# Altium project Tx_TFT_PCB.PrjPcb (part 2 of 2)

## Sheet Power_2.SchDoc
size A4; Organization: Altium Limited; Address1: L3, 12a Rodborough Rd; Address2: Frenchs Forest; Address3: NSW; Address4: Australia 2086
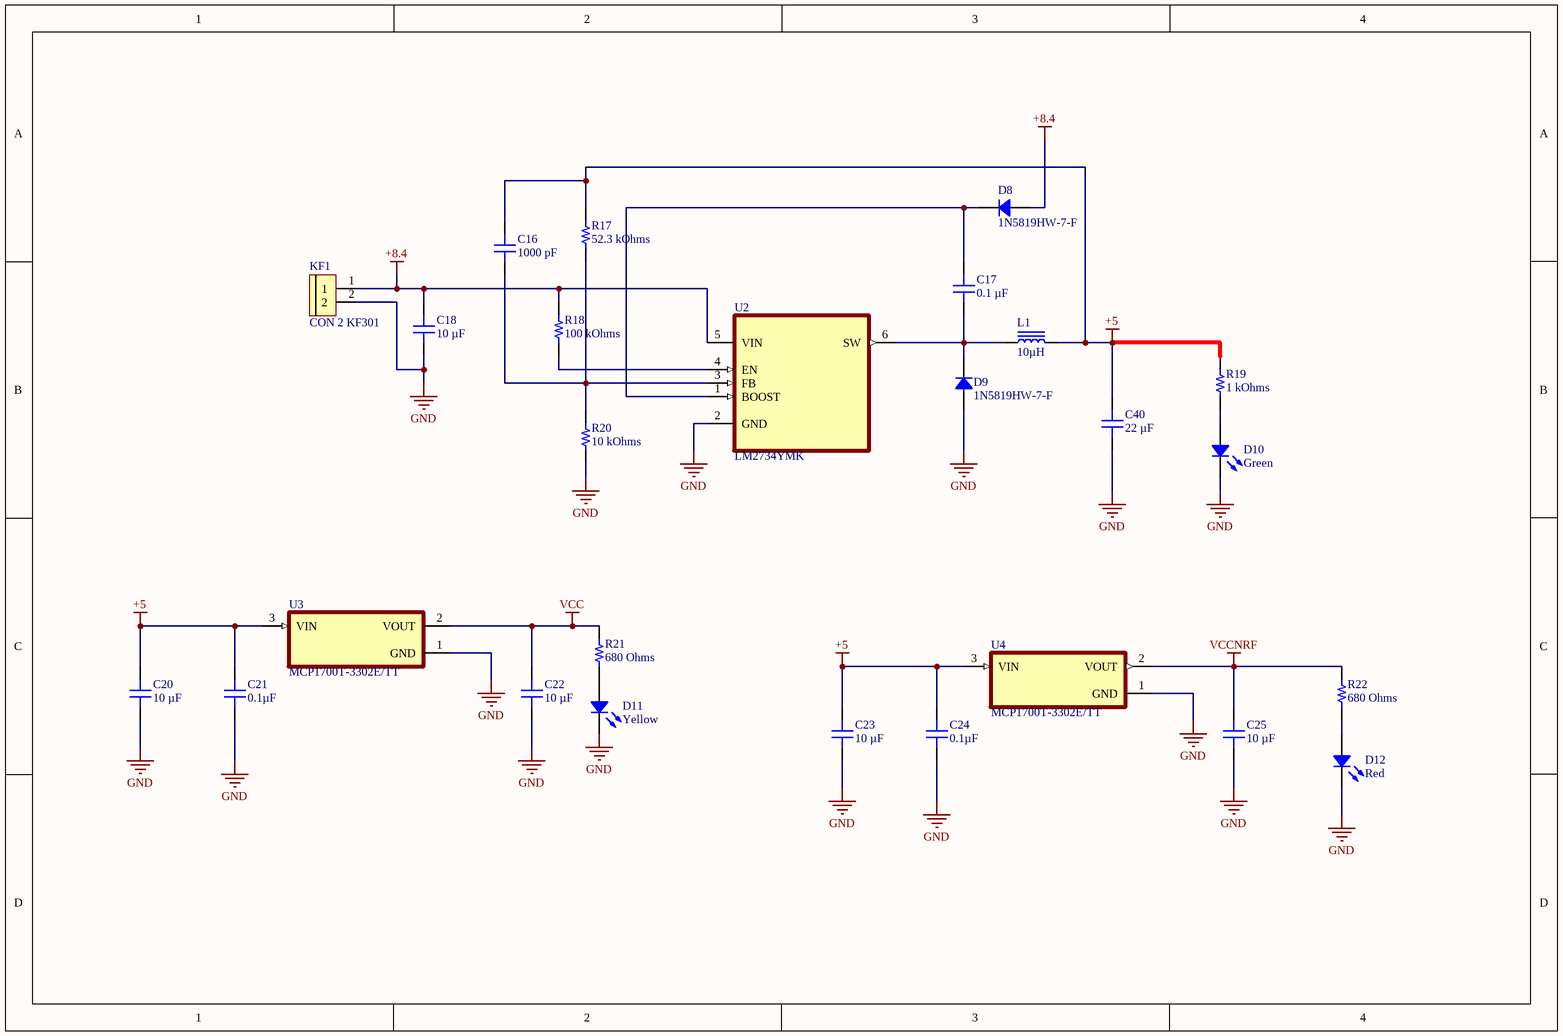
[diagram p2: Power_2.SchDoc]

### Parts
C16  1000 pF  [CAP 0603_1608]
C17  0.1 µF  [CAP 0603_1608]
C18  10 µF  [CAP 0805_2012]
C20  10 µF  [CAP 0805_2012]
C21  0.1µF  [CAP 0603_1608]
C22  10 µF  [CAP 0603_1608]
C23  10 µF  [CAP 0805_2012]
C24  0.1µF  [CAP 0603_1608]
C25  10 µF  [CAP 0603_1608]
C40  22 µF  [CAP 0805_2012]
D8  1N5819HW-7-F  [SOD-123]
D9  1N5819HW-7-F  [SOD-123]
D10  Green  [LED 0603_1608 GREEN]
D11  Yellow  [LED 0603_1608 YELLOW]
D12  Red  [LED 0603_1608 RED]
KF1  CON 2 KF301  [Con 2 KF301 5.08]
L1  10µH  [TDK SLF7032]
R17  52.3 kOhms  [RES 0603_1608]
R18  100 kOhms  [RES 0603_1608]
R19  1 kOhms  [RES 0603_1608]
R20  10 kOhms  [RES 0603_1608]
R21  680 Ohms  [RES 0603_1608]
R22  680 Ohms  [RES 0603_1608]
U2  LM2734YMK  [SOT95P285X100-6N]
U3  MCP1700T-3302E/TT  [SOT95P237X112-3N]
U4  MCP1700T-3302E/TT  [SOT95P237X112-3N]

### Nets
+5: C16.2 C20.2 C21.2 C23.2 C24.2 C40.2 L1.2 R17.2 R19.2 U3.3(VIN) U4.3(VIN)
+8.4: C18.2 D8.1 KF1.1 R18.2 U2.5(VIN)
GND: C18.1 C20.1 C21.1 C22.1 C23.1 C24.1 C25.1 C40.1 D9.1 D10.2 D11.2 D12.2 KF1.2 R20.1 U2.2(GND) U3.1(GND) U4.1(GND)
VCC: C22.2 R21.2 U3.2(VOUT)
VCCNRF: C25.2 R22.2 U4.2(VOUT)
NetC16_1: C16.1 R17.1 R20.2 U2.3(FB)
NetC17_1: C17.1 D9.2 L1.1 U2.6(SW)
NetC17_2: C17.2 D8.2 U2.1(BOOST)
NetD10_1: D10.1 R19.1
NetD11_1: D11.1 R21.1
NetD12_1: D12.1 R22.1
NetR18_1: R18.1 U2.4(EN)

### Notes on the sheet
- Title
- Size:
- Date:
- A4
- Number:
- Time:
- Revision:
- Sheet
- of
- File:

### Library data of the parts
C16 = VJ0603Y102KXQCW1BC: CAP CER 1000PF 10V X7R 0603; manufacturer: Vishay Vitramon; Tolerance: ±10%; Part Number: VJ0603Y102KXQCW1BC; Value: 1000 pF; Applications: General Purpose; Capacitance: 1000 pF; componentlink1description: Datasheet; componentlink1url: https://www.vishay.com/docs/28548/vjw1bcbascomseries.pdf; componentlink2description: DigiKey Link; componentlink2url: https://www.digikey.com/en/products/detail/vishay-vitramon/VJ0603Y102KXQCW1BC/8305229; Device Package: 0603 (1608 Metric); lastupdated: 2/9/2024 8:10:13 PM; Lifecycle Status: Active; Minimum Order: 1; Mounting Type: Surface Mount, MLCC; Operating Temperature: -55°C ~ 125°C; Package / Case: 0603 (1608 Metric); packaging: TapeAndReel; partid: 14875; Part Status: Active; price: 0.01; series: VJ W1BC; Size / Dimension: 0.063" L x 0.031" W (1.60mm x 0.80mm); Supplier 1: DigiKey; Supplier Part Number 1: 720-1679-1-ND; Temperature Coefficient: X7R; Thickness (Max): 0.034" (0.87mm); Voltage - Rated: 10V
C17 = CX0603MRX7R6BB104: CAP CER 0.1UF 10V X7R 0603; manufacturer: PulseLarsen Antennas; Tolerance: ±20%; Part Number: CX0603MRX7R6BB104; Value: 0.1 µF; Applications: Bypass, Decoupling; Capacitance: 0.1 µF; componentlink1description: Datasheet; componentlink1url: https://productfinder.pulseelectronics.com/api/open/product-attachments/datasheet/cx0805mrx7r0bb102; componentlink2description: DigiKey Link; componentlink2url: https://www.digikey.com/en/products/detail/pulselarsen-antennas/CX0603MRX7R6BB104/1219074; Device Package: 0603 (1608 Metric); Features: Low ESL (X2Y); lastupdated: 2/9/2024 8:09:55 PM; Lifecycle Status: Active; Minimum Order: 1; Mounting Type: Surface Mount, MLCC; Operating Temperature: -55°C ~ 125°C; Package / Case: 0603 (1608 Metric); packaging: TapeAndReel; partid: 34696; Part Status: Active; price: 0.09; series: X2Y®; Size / Dimension: 0.063" L x 0.033" W (1.60mm x 0.85mm); Supplier 1: DigiKey; Supplier Part Number 1: 311-1237-1-ND; Temperature Coefficient: X7R; Thickness (Max): 0.030" (0.75mm); Voltage - Rated: 10V
C18 = CL21A106KOQNNWE: CAP CER 10UF 16V X5R 0805; manufacturer: Samsung Electro-Mechanics; Tolerance: ±10%; Part Number: CL21A106KOQNNWE; Value: 10 µF; Applications: General Purpose; Capacitance: 10 µF; componentlink1description: Datasheet; componentlink1url: http://www.samsungsem.com/kr/support/product-search/mlcc/CL21A106KOQNNWE.jsp; componentlink2description: DigiKey Link; componentlink2url: https://www.digikey.com/en/products/detail/samsung-electro-mechanics/CL21A106KOQNNWE/3888552; Device Package: 0805 (2012 Metric); lastupdated: 2/9/2024 8:15:45 PM; Lifecycle Status: Active; Minimum Order: 1; Mounting Type: Surface Mount, MLCC; Operating Temperature: -55°C ~ 85°C; Package / Case: 0805 (2012 Metric); packaging: TapeAndReel; partid: 11753; Part Status: Active; price: 0.02; series: CL; Size / Dimension: 0.079" L x 0.049" W (2.00mm x 1.25mm); Supplier 1: DigiKey; Supplier Part Number 1: 1276-2894-1-ND; Temperature Coefficient: X5R; Thickness (Max): 0.055" (1.40mm); Voltage - Rated: 16V
C20 C23 = CL21A106KOQNNNG: CAP CER 10UF 16V X5R 0805; manufacturer: Samsung Electro-Mechanics; Tolerance: ±10%; Part Number: CL21A106KOQNNNG; Value: 10 µF; Applications: General Purpose; Capacitance: 10 µF; componentlink1description: Datasheet; componentlink1url: http://www.samsungsem.com/kr/support/product-search/mlcc/CL21A106KOQNNNG.jsp; componentlink2description: DigiKey Link; componentlink2url: https://www.digikey.com/en/products/detail/samsung-electro-mechanics/CL21A106KOQNNNG/3894417; Device Package: 0805 (2012 Metric); lastupdated: 2/9/2024 8:15:59 PM; Lifecycle Status: Active; Minimum Order: 1; Mounting Type: Surface Mount, MLCC; Operating Temperature: -55°C ~ 85°C; Package / Case: 0805 (2012 Metric); packaging: TapeAndReel; partid: 39874; Part Status: Active; price: 0.01; series: CL; Size / Dimension: 0.079" L x 0.049" W (2.00mm x 1.25mm); Supplier 1: DigiKey; Supplier Part Number 1: 1276-6455-1-ND; Temperature Coefficient: X5R; Thickness (Max): 0.055" (1.40mm); Voltage - Rated: 16V
C21 = LD03ZC104KAB2A: CAP CER 0.1UF 10V X7R 0603; manufacturer: AVX Corporation; Tolerance: ±10%; Part Number: LD03ZC104KAB2A; Value: 0.1µF; Applications: General Purpose; Capacitance: 0.1µF; componentlink1description: Datasheet; componentlink1url: http://datasheets.avx.com/LD-Series.pdf; componentlink2description: DigiKey Link; componentlink2url: http://digikey.com/product-detail/en/avx-corporation/LD03ZC104KAB2A/478-12926-1-ND/9949296; Device Package: 0603 (1608 Metric); lastupdated: 9/2/2020 1:03:06 AM; Lifecycle Status: Active; Minimum Order: 1; Mounting Type: Surface Mount, MLCC; Operating Temperature: -55°C ~ 125°C; Package / Case: 0603 (1608 Metric); packaging: TapeAndReel; partid: 16481; Part Status: Active; price: 0.17; series: LD; Size / Dimension: 0.063" L x 0.032" W (1.60mm x 0.81mm); Supplier 1: DigiKey; Supplier Part Number 1: 478-12926-1-ND; Temperature Coefficient: X7R; Thickness (Max): 0.035" (0.90mm); Voltage - Rated: 10V
C22 C25 = KGM15CS61A106MT: CAP CER 10UF 10V X6S 0603; manufacturer: KYOCERA AVX; Tolerance: ±20%; Part Number: KGM15CS61A106MT; Value: 10 µF; Applications: General Purpose; Capacitance: 10 µF; componentlink1description: Datasheet; componentlink1url: https://ele.kyocera.com/assets/products/capacitor/CM_Series_e.pdf; componentlink2description: DigiKey Link; componentlink2url: https://www.digikey.com/en/products/detail/kyocera-avx/KGM15CS61A106MT/12397342; Device Package: 0603 (1608 Metric); lastupdated: 2/9/2024 8:09:23 PM; Lifecycle Status: Active; Minimum Order: 1; Mounting Type: Surface Mount, MLCC; Operating Temperature: -55°C ~ 105°C; Package / Case: 0603 (1608 Metric); packaging: TapeAndReel; partid: 51317; Part Status: Active; price: 0.04; series: KGM - X6S; Size / Dimension: 0.063" L x 0.031" W (1.60mm x 0.80mm); Supplier 1: DigiKey; Supplier Part Number 1: 478-KGM15CS61A106MTCT-ND; Temperature Coefficient: X6S; Thickness (Max): 0.039" (1.00mm); Voltage - Rated: 10V
C24 = 0603YC104JAZ2A: CAP CER 0.1UF 16V X7R 0603; manufacturer: AVX Corporation; Tolerance: ±5%; Part Number: 0603YC104JAZ2A; Value: 0.1µF; Applications: Boardflex Sensitive; Capacitance: 0.1µF; componentlink1description: Datasheet; componentlink1url: http://datasheets.avx.com/FlexitermMLCC.pdf; componentlink2description: DigiKey Link; componentlink2url: http://digikey.com/product-detail/en/avx-corporation/0603YC104JAZ2A/478-5291-1-ND/1950958; Device Package: 0603 (1608 Metric); Features: Soft Termination; lastupdated: 9/2/2020 1:03:16 AM; Lifecycle Status: Active; Minimum Order: 1; Mounting Type: Surface Mount, MLCC; Operating Temperature: -55°C ~ 125°C; Package / Case: 0603 (1608 Metric); packaging: TapeAndReel; partid: 13201; Part Status: Active; price: 0.11; series: FLEXITERM®; Size / Dimension: 0.063" L x 0.032" W (1.60mm x 0.81mm); Supplier 1: DigiKey; Supplier Part Number 1: 478-5291-1-ND; Temperature Coefficient: X7R; Thickness (Max): 0.035" (0.90mm); Voltage - Rated: 16V
C40 = C2012X5R1A226M125AE: CAP CER 22UF 10V X5R 0805; manufacturer: TDK Corporation; Tolerance: ±20%; Part Number: C2012X5R1A226M125AE; Value: 22 µF; Applications: Boardflex Sensitive; Capacitance: 22 µF; componentlink1description: Datasheet; componentlink1url: https://product.tdk.com/info/en/catalog/datasheets/mlcc_commercial_soft_en.pdf?ref_disty=digikey; componentlink2description: DigiKey Link; componentlink2url: https://www.digikey.com/en/products/detail/tdk-corporation/C2012X5R1A226M125AE/9991384; Device Package: 0805 (2012 Metric); Features: Soft Termination; lastupdated: 2/9/2024 8:15:35 PM; Lifecycle Status: Active; Minimum Order: 1; Mounting Type: Surface Mount, MLCC; Operating Temperature: -55°C ~ 85°C; Package / Case: 0805 (2012 Metric); packaging: TapeAndReel; partid: 39859; Part Status: Active; price: 0.36; series: C; Size / Dimension: 0.079" L x 0.049" W (2.00mm x 1.25mm); Supplier 1: DigiKey; Supplier Part Number 1: 445-C2012X5R1A226M125AECT-ND; Temperature Coefficient: X5R; Thickness (Max): 0.059" (1.50mm); Voltage - Rated: 10V
D8 D9 = 1N5819HW-7-F: DIODE SCHOTTKY 40V 1A SOD123; Manufacturer: Diodes Incorporated; Capacitance @ Vr, F: 60pF @ 4V, 1MHz; Current - Reverse Leakage @ Vr: 1 mA @ 40 V; Speed: Fast Recovery =< 500ns, > 200mA (Io); Voltage - Forward (Vf) (Max) @ If: 450 mV @ 1 A; Part Number: 1N5819HW-7-F; ComponentLink1Description: Datasheet; ComponentLink1URL: https://www.diodes.com/assets/Datasheets/ds30217.pdf; ComponentLink2Description: DigiKey Link; ComponentLink2URL: https://www.digikey.com/en/products/detail/diodes-incorporated/1N5819HW-7-F/814970; Current - Average Rectified (Io): 1A; Diode Type: Schottky; LastUpdated: 6/3/2024 7:54:46 PM; Lifecycle Status: Active; Minimum Order: 1; Mounting Type: Surface Mount; Operating Temperature - Junction: -65°C ~ 125°C; Package / Case: SOD-123; Packaging: TapeAndReel; PartId: 2212; Part Status: Active; Price: 0.05; Series: -; Supplier 1: DigiKey; Supplier Part Number 1: 1N5819HW-FDICT-ND; Supplier Device Package: SOD-123; Voltage - DC Reverse (Vr) (Max): 40 V
D10 = QBLP601-IG: LED GREEN CLEAR 0603 SMD; Manufacturer: QT Brightek (QTB); Configuration: Standard; Current - Test: 20mA; Lens Color: Colorless; Lens Size: 1.10mm x 0.80mm; Lens Style: Rectangle with Flat Top; Millicandela Rating: 450mcd; Viewing Angle: 140°; Voltage - Forward (Vf) (Typ): 3.2V; Wavelength - Dominant: 525nm; Part Number: QBLP601-IG; Color: Green; ComponentLink1Description: Datasheet; ComponentLink1URL: http://www.qt-brightek.com/datasheet/QBLP601_series.pdf; ComponentLink2Description: DigiKey Link; ComponentLink2URL: https://www.digikey.com/en/products/detail/qt-brightek-qtb/QBLP601-IG/4814653; Device Package: 0603 (1608 Metric); Height (Max): 0.60mm; LastUpdated: 6/3/2024 7:58:52 PM; Lens Transparency: Clear; Lifecycle Status: Active; Minimum Order: 1; Mounting Type: Surface Mount; Package / Case: 0603 (1608 Metric); Packaging: TapeAndReel; PartId: 668; Part Status: Active; Price: 0.06; Series: QBLP601; Size / Dimension: 1.60mm L x 0.80mm W; Supplier 1: DigiKey; Supplier Part Number 1: 1516-1055-1-ND; Supplier Device Package: 0603; Value: Green
D11 = VAOL-S6YP4: LED YELLOW CLEAR 0603 SMD; Manufacturer: Visual Communications Company - VCC; Configuration: Standard; Current - Test: 10mA; Lens Color: Colorless; Lens Size: 1.20mm x 0.80mm; Lens Style: Rectangle with Flat Top; Millicandela Rating: 33mcd; Viewing Angle: 120°; Voltage - Forward (Vf) (Typ): 1.9V; Wavelength - Dominant: 591nm; Part Number: VAOL-S6YP4; Color: Yellow; ComponentLink1Description: Datasheet; ComponentLink1URL: http://vcclite.com/_pdf/VAOL-S6YP4-LED-0603-yellow.pdf; ComponentLink2Description: DigiKey Link; ComponentLink2URL: http://digikey.com/product-detail/en/visual-communications-company-vcc/VAOL-S6YP4/VAOL-S6YP4CT-ND/5176154; Device Package: 0603 (1608 Metric); Height (Max): 0.60mm; LastUpdated: 6/3/2024 8:01:09 PM; Lens Transparency: Clear; Lifecycle Status: Active; Minimum Order: 1; Mounting Type: Surface Mount; Package / Case: 0603 (1608 Metric); Packaging: TapeAndReel; PartId: 153; Part Status: Active; Price: 0.09; Series: -; Size / Dimension: 1.60mm L x 0.80mm W; Supplier 1: DigiKey; Supplier Part Number 1: VAOL-S6YP4CT-ND; Supplier Device Package: 0603; Value: Yellow; Wavelength - Peak: 591nm
D12 = B18W1URO-20C000114U1930: LED RED CLEAR 0603 SMD; Manufacturer: Harvatek Corporation; Current - Test: 20mA; Lens Color: Colorless; Lens Size: 0.80mm Dia; Lens Style: Round with Flat Top; Millicandela Rating: 360mcd; Viewing Angle: 55°; Voltage - Forward (Vf) (Typ): 2.1V; Wavelength - Dominant: 630nm; Wavelength - Peak: 639nm; Part Number: B18W1URO-20C000114U1930; Color: Red; ComponentLink1Description: Datasheet; ComponentLink1URL: https://media.digikey.com/pdf/Data%20Sheets/Harvatek%20PDFs/B18W1URO-20C000114U1930.pdf; ComponentLink2Description: DigiKey Link; ComponentLink2URL: https://www.digikey.com/en/products/detail/harvatek-corporation/B18W1URO-20C000114U1930/16671735; Device Package: 0603 (1608 Metric); Height (Max): 1.05mm; LastUpdated: 6/3/2024 7:59:44 PM; Lens Transparency: Clear; Lifecycle Status: Active; Minimum Order: 1; Mounting Type: Surface Mount; Package / Case: 0603 (1608 Metric); Packaging: TapeAndReel; PartId: 1174; Part Status: Active; Price: 0.16; Series: B18W1URO; Size / Dimension: 1.60mm L x 0.80mm W; Supplier 1: DigiKey; Supplier Part Number 1: 3147-B18W1URO-20C000114U1930CT-ND; Supplier Device Package: 0603; Value: Red
KF1 = CON 2 KF301: Cắm; Ma_Hang: MH000987; Ten_Linh_Kien: CON 2 KF301-2P 5.08MM Xanh Dương; Chung_Loai: Cắm; Ghi_Chu: *; Kieu_Chan: *; Don_Vi: Con
L1 = SLF7032T-100M1R4-2PF: FIXED IND 10UH 1.4A 63.6 MOHM; Manufacturer: TDK Corporation; DC Resistance (DCR): 63.6mOhm Max; Inductance Frequency - Test: 100kHz; Material - Core: Ferrite; Shielding: Shielded; Tolerance: ±20%; Type: Wirewound; Part Number: SLF7032T-100M1R4-2PF; ComponentLink1Description: Datasheet; ComponentLink1URL: //media.digikey.com/pdf/Data%20Sheets/TDK%20PDFs/SLF7032_Type.pdf; ComponentLink2Description: DigiKey Link; ComponentLink2URL: http://digikey.com/product-detail/en/tdk-corporation/SLF7032T-100M1R4-2PF/445-1998-1-ND/755405; Current Rating (Amps): 1.4A; Device Package: Nonstandard; Height - Seated (Max): 0.134" (3.40mm); Inductance: 10µH; LastUpdated: 9/2/2020 1:30:24 AM; Lifecycle Status: Active; Minimum Order: 1; Mounting Type: Surface Mount; Operating Temperature: -40°C ~ 105°C; Package / Case: Nonstandard; Packaging: TapeAndReel; PartId: 3677; Part Status: Active; Price: 0.43; Series: SLF; Size / Dimension: 0.276" L x 0.276" W (7.00mm x 7.00mm); Supplier 1: DigiKey; Supplier Part Number 1: 445-1998-1-ND; Value: 10µH
R17 = RMEF0603FT52K3: RES 52.3K OHM 1% 1/10W 0603; Manufacturer: Stackpole Electronics Inc; Power (Watts): 0.1W, 1/10W; Ratings: 7C1 RoHS w/out Exemption (100% Pb-Free), AEC-Q200; Temperature Coefficient: ±100ppm/°C; Part Number: RMEF0603FT52K3; Value: 52.3 kOhms; ComponentLink1Description: Datasheet; ComponentLink1URL: https://www.seielect.com/Catalog/SEI-RMEF.pdf; ComponentLink2Description: DigiKey Link; ComponentLink2URL: https://www.digikey.com/en/products/detail/stackpole-electronics-inc/RMEF0603FT52K3/16839815; Composition: Thick Film; Device Package: 0603 (1608 Metric); Features: Automotive AEC-Q200; Height - Seated (Max): 0.020" (0.50mm); LastUpdated: 2/9/2024 8:41:04 PM; Lifecycle Status: Active; Minimum Order: 1; Number of Terminations: 2; Operating Temperature: -55°C ~ 155°C; Package / Case: 0603 (1608 Metric); Packaging: TapeAndReel; PartId: 69499; Part Status: Active; Price: 0.01; Resistance: 52.3 kOhms; Series: RMEF; Size / Dimension: 0.063" L x 0.031" W (1.60mm x 0.80mm); Supplier 1: DigiKey; Supplier Part Number 1: 738-RMEF0603FT52K3CT-ND; Supplier Device Package: 0603; Tolerance: ±1%
R18 = TNPW0603100KBXEN: RES 100K OHM 0.1% 1/10W 0603; Manufacturer: Vishay Dale; Power (Watts): 0.1W, 1/10W; Temperature Coefficient: ±15ppm/°C; Part Number: TNPW0603100KBXEN; Value: 100 kOhms; ComponentLink1Description: Datasheet; ComponentLink1URL: http://www.vishay.com/docs/28758/tnpw_e3.pdf; ComponentLink2Description: DigiKey Link; ComponentLink2URL: https://www.digikey.com/en/products/detail/vishay-dale/TNPW0603100KBXEN/4155839; Composition: Thin Film; Device Package: 0603 (1608 Metric); Features: Anti-Sulfur, Automotive AEC-Q200, Moisture Resistant; Height - Seated (Max): 0.022" (0.55mm); LastUpdated: 2/9/2024 8:42:03 PM; Lifecycle Status: Active; Minimum Order: 1; Number of Terminations: 2; Operating Temperature: -55°C ~ 155°C; Package / Case: 0603 (1608 Metric); Packaging: TapeAndReel; PartId: 25339; Part Status: Active; Price: 0.31; Ratings: AEC-Q200; Resistance: 100 kOhms; Series: TNPW e3; Size / Dimension: 0.063" L x 0.033" W (1.60mm x 0.85mm); Supplier 1: DigiKey; Supplier Part Number 1: 541-1721-1-ND; Supplier Device Package: 0603; Tolerance: ±0.1%
R19 = RG1608V-102-B-T5: RES SMD 1K OHM 0.1% 1/10W 0603; Manufacturer: Susumu; Power (Watts): 0.1W, 1/10W; Temperature Coefficient: ±5ppm/°C; Part Number: RG1608V-102-B-T5; Value: 1 kOhms; ComponentLink1Description: Datasheet; ComponentLink1URL: https://www.susumu.co.jp/common/pdf/n_catalog_partition01_en.pdf; ComponentLink2Description: DigiKey Link; ComponentLink2URL: https://www.digikey.com/en/products/detail/susumu/RG1608V-102-B-T5/1258937; Composition: Thin Film; Device Package: 0603 (1608 Metric); Features: Anti-Sulfur, Automotive AEC-Q200; Height - Seated (Max): 0.020" (0.50mm); LastUpdated: 2/9/2024 8:40:32 PM; Lifecycle Status: Active; Minimum Order: 1; Number of Terminations: 2; Operating Temperature: -55°C ~ 155°C; Package / Case: 0603 (1608 Metric); Packaging: TapeAndReel; PartId: 82062; Price: 0.78; Ratings: AEC-Q200; Resistance: 1 kOhms; Series: RG; Size / Dimension: 0.063" L x 0.031" W (1.60mm x 0.80mm); Supplier 1: DigiKey; Supplier Part Number 1: 408-RG1608V-102-B-T5CT-ND; Supplier Device Package: 0603; Tolerance: ±0.1%
R20 = CPF-A-0603B10KE1: RES SMD 10K OHM 0.1% 1/16W 0603; Manufacturer: TE Connectivity Passive Product; Power (Watts): 0.063W, 1/16W; Temperature Coefficient: ±25ppm/°C; Part Number: CPF-A-0603B10KE1; Value: 10 kOhms; ComponentLink1Description: Datasheet; ComponentLink1URL: https://www.te.com/commerce/DocumentDelivery/DDEController?Action=srchrtrv&DocNm=1773200-1&DocType=DS&DocLang=English; ComponentLink2Description: DigiKey Link; ComponentLink2URL: https://www.digikey.com/en/products/detail/te-connectivity-passive-product/CPF-A-0603B10KE1/5586834; Composition: Thin Film; Device Package: 0603 (1608 Metric); Features: Anti-Sulfur, Automotive AEC-Q200, Moisture Resistant; Height - Seated (Max): 0.022" (0.55mm); LastUpdated: 2/9/2024 8:40:47 PM; Lifecycle Status: Active; Minimum Order: 1; Number of Terminations: 2; Operating Temperature: -55°C ~ 155°C; Package / Case: 0603 (1608 Metric); Packaging: TapeAndReel; PartId: 75468; Part Status: Active; Price: 0.12; Ratings: AEC-Q200; Resistance: 10 kOhms; Series: CPF-A, Neohm; Size / Dimension: 0.061" L x 0.031" W (1.55mm x 0.80mm); Supplier 1: DigiKey; Supplier Part Number 1: 1712-CPF-A-0603B10KE1CT-ND; Supplier Device Package: 0603; Tolerance: ±0.1%
R21 R22 = CPF-A-0603B680RE: RES SMD 680 OHM 0.1% 1/16W 0603; Manufacturer: TE Connectivity Passive Product; Power (Watts): 0.063W, 1/16W; Temperature Coefficient: ±25ppm/°C; Part Number: CPF-A-0603B680RE; Value: 680 Ohms; ComponentLink1Description: Datasheet; ComponentLink1URL: https://www.te.com/commerce/DocumentDelivery/DDEController?Action=srchrtrv&DocNm=1773200-1&DocType=DS&DocLang=English; ComponentLink2Description: DigiKey Link; ComponentLink2URL: https://www.digikey.com/en/products/detail/te-connectivity-passive-product/CPF-A-0603B680RE/5583848; Composition: Thin Film; Device Package: 0603 (1608 Metric); Features: Anti-Sulfur, Automotive AEC-Q200, Moisture Resistant; Height - Seated (Max): 0.022" (0.55mm); LastUpdated: 2/9/2024 8:42:04 PM; Lifecycle Status: Active; Minimum Order: 1; Number of Terminations: 2; Operating Temperature: -55°C ~ 155°C; Package / Case: 0603 (1608 Metric); Packaging: TapeAndReel; PartId: 25303; Part Status: Active; Price: 0.09; Ratings: AEC-Q200; Resistance: 680 Ohms; Series: CPF-A, Neohm; Size / Dimension: 0.061" L x 0.031" W (1.55mm x 0.80mm); Supplier 1: DigiKey; Supplier Part Number 1: 1712-CPF-A-0603B680RECT-ND; Supplier Device Package: 0603; Tolerance: ±0.1%
U2 = LM2734YMK: Buck Switching Regulator IC Positive Adjustable 0.8V 1 Output 1A SOT-23-6 Thin, TSOT-23-6; MF: Texas Instruments; SnapEDA_Link: https://www.snapeda.com/parts/LM2734YMK/Texas%20Instruments/view-part/105783/?ref=snap; Price: None; Availability: Unavailable; Package: SOT-23 Texas Instruments; MP: LM2734YMK; Value: *
U3 U4 = MCP1700T-3302E/TT: Linear Voltage Regulator IC 1 Output 250mA SOT-23-3; MF: Microchip; Availability: Unavailable; Value: *; Package: SOT-23-3 Microchip; Price: None; MP: MCP1700T-3302E/TT; SnapEDA_Link: https://www.snapeda.com/parts/MCP1700T-3302E/TT/Microchip/view-part/50877/?ref=snap

## Sheet USB_C.SchDoc
size A3; Organization: Altium Limited; Address1: L3, 12a Rodborough Rd; Address2: Frenchs Forest; Address3: NSW; Address4: Australia 2086
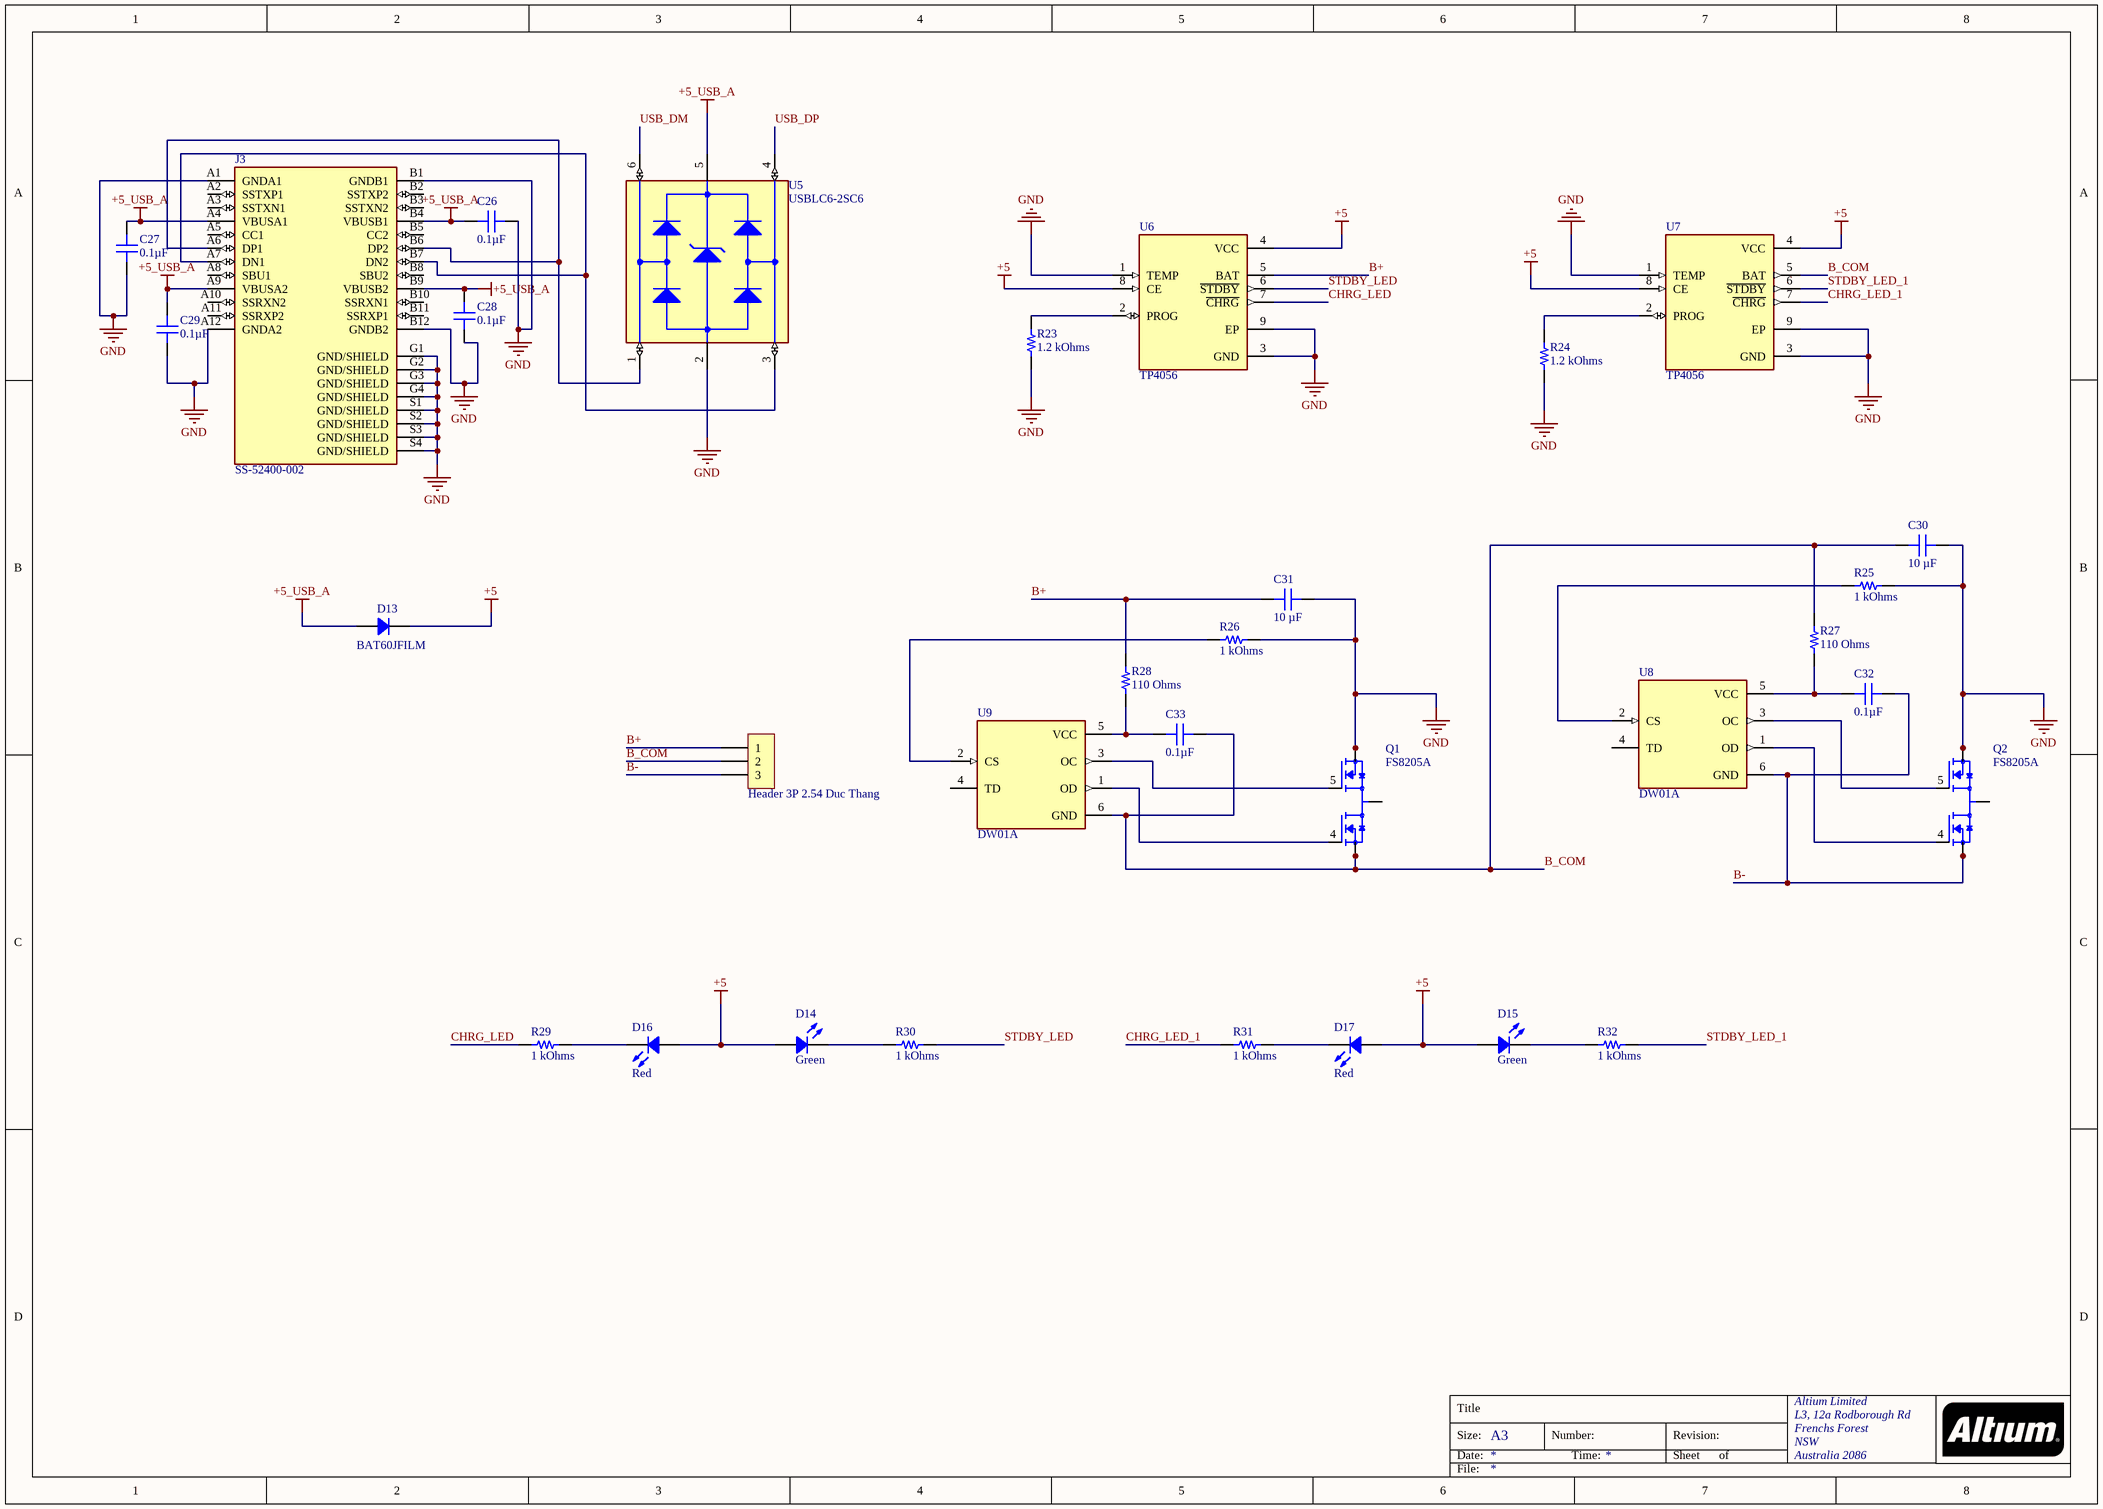
[diagram p3: USB_C.SchDoc]

### Parts
C26  0.1µF  [CAP 0603_1608]
C27  0.1µF  [CAP 0603_1608]
C28  0.1µF  [CAP 0603_1608]
C29  0.1µF  [CAP 0603_1608]
C30  10 µF  [CAP 0603_1608]
C31  10 µF  [CAP 0603_1608]
C32  0.1µF  [CAP 0603_1608]
C33  0.1µF  [CAP 0603_1608]
D13  BAT60JFILM  [SOD323]
D14  Green  [LED 0603_1608 GREEN]
D15  Green  [LED 0603_1608 GREEN]
D16  Red  [LED 0603_1608 RED]
D17  Red  [LED 0603_1608 RED]
H1  Header 3P 2.54 Duc Thang  [XH2.54M-3]
J3  SS-52400-002  [BELFUSE_SS-52400-002]
Q1  FS8205A  [SOP65P640X120-8N]
Q2  FS8205A  [SOP65P640X120-8N]
R23  1.2 kOhms  [RES 0402_1005]
R24  1.2 kOhms  [RES 0402_1005]
R25  1 kOhms  [RES 0603_1608]
R26  1 kOhms  [RES 0603_1608]
R27  110 Ohms  [RES 0603_1608]
R28  110 Ohms  [RES 0603_1608]
R29  1 kOhms  [RES 0603_1608]
R30  1 kOhms  [RES 0603_1608]
R31  1 kOhms  [RES 0603_1608]
R32  1 kOhms  [RES 0603_1608]
U5  USBLC6-2SC6  [SOT95P280X145-6N]
U6  TP4056  [SOP127P600X175-9N]
U7  TP4056  [SOP127P600X175-9N]
U8  DW01A  [SOT95P280X145-6N]
U9  DW01A  [SOT95P280X145-6N]

### Nets
+5: D13.2 D14.1 D15.1 D16.1 D17.1 U6.4(VCC) U6.8(CE) U7.4(VCC) U7.8(CE)
+5_USB_A: C26.2 C27.2 C28.2 C29.2 D13.1 J3.A4(VBUSA1) J3.A9(VBUSA2) J3.B4(VBUSB1) J3.B9(VBUSB2) U5.5(VBUS)
GND: C26.1 C27.1 C28.1 C29.1 C30.2 C31.2 J3.A1(GNDA1) J3.A12(GNDA2) J3.B1(GNDB1) J3.B12(GNDB2) J3.G1(GND/SHIELD) J3.G2(GND/SHIELD) J3.G3(GND/SHIELD) J3.G4(GND/SHIELD) J3.S1(GND/SHIELD) J3.S2(GND/SHIELD) J3.S3(GND/SHIELD) J3.S4(GND/SHIELD) Q1.6(S2) Q1.7(S2) Q2.6(S2) Q2.7(S2) R23.1 R24.1 R25.2 R26.2 U5.2(GND) U6.1(TEMP) U6.3(GND) U6.9(EP) U7.1(TEMP) U7.3(GND) U7.9(EP)
B+: C31.1 H1.1 R28.2 U6.5(BAT)
B-: C32.1 H1.3 Q2.2(S1) Q2.3(S1) U8.6(GND)
B_COM: C30.1 C33.1 H1.2 Q1.2(S1) Q1.3(S1) R27.2 U7.5(BAT) U9.6(GND)
CHRG_LED: R29.1 U6.7(~{CHRG})
CHRG_LED_1: R31.1 U7.7(~{CHRG})
STDBY_LED: R30.2 U6.6(~{STDBY})
STDBY_LED_1: R32.2 U7.6(~{STDBY})
USB_DM: U5.6(I/O1_OUT)
USB_DP: U5.4(I/O2_OUT)
NetC32_2: C32.2 R27.1 U8.5(VCC)
NetC33_2: C33.2 R28.1 U9.5(VCC)
NetD14_2: D14.2 R30.1
NetD15_2: D15.2 R32.1
NetD16_2: D16.2 R29.2
NetD17_2: D17.2 R31.2
NetJ3_A6: J3.A6(DP1) J3.B6(DP2) U5.1(I/O1_IN)
NetJ3_A7: J3.A7(DN1) J3.B7(DN2) U5.3(I/O2_IN)
NetQ1_1: Q1.1(D12) Q1.8(D12)
NetQ1_4: Q1.4(G1) U9.1(OD)
NetQ1_5: Q1.5(G2) U9.3(OC)
NetQ2_1: Q2.1(D12) Q2.8(D12)
NetQ2_4: Q2.4(G1) U8.1(OD)
NetQ2_5: Q2.5(G2) U8.3(OC)
NetR23_2: R23.2 U6.2(PROG)
NetR24_2: R24.2 U7.2(PROG)
NetR25_1: R25.1 U8.2(CS)
NetR26_1: R26.1 U9.2(CS)

Not connected (* = marked no-connect by the designer): J3 A2(SSTXP1) A3(SSTXN1) A5(CC1) A8(SBU1) A10(SSRXN2) A11(SSRXP2) B2(SSTXP2) B3(SSTXN2) B5(CC2) B8(SBU2) B10(SSRXN1) B11(SSRXP1); U8 4(TD); U9 4(TD)

### Notes on the sheet
- Title
- Size:
- Date:
- A3
- Number:
- Time:
- Revision:
- Sheet
- of
- File:

### Library data of the parts
C26-C29 C32 C33 = LD03YC104JAB2A: CAP CER 0.1UF 16V X7R 0603; manufacturer: AVX Corporation; Tolerance: ±5%; Part Number: LD03YC104JAB2A; Value: 0.1µF; Applications: General Purpose; Capacitance: 0.1µF; componentlink1description: Datasheet; componentlink1url: http://datasheets.avx.com/LD-Series.pdf; componentlink2description: DigiKey Link; componentlink2url: http://digikey.com/product-detail/en/avx-corporation/LD03YC104JAB2A/478-4928-1-ND/1858874; Device Package: 0603 (1608 Metric); lastupdated: 9/2/2020 1:03:21 AM; Lifecycle Status: Active; Minimum Order: 1; Mounting Type: Surface Mount, MLCC; Operating Temperature: -55°C ~ 125°C; Package / Case: 0603 (1608 Metric); packaging: TapeAndReel; partid: 10388; Part Status: Active; price: 0.19; series: LD; Size / Dimension: 0.063" L x 0.032" W (1.60mm x 0.81mm); Supplier 1: DigiKey; Supplier Part Number 1: 478-4928-1-ND; Temperature Coefficient: X7R; Thickness (Max): 0.035" (0.90mm); Voltage - Rated: 16V
C30 C31 = ZRB18AC81A106KE01L: CAP CER 10UF 10V X6S 0603; manufacturer: Murata Electronics; Tolerance: ±10%; Part Number: ZRB18AC81A106KE01L; Value: 10 µF; Applications: Acoustic Noise Reduction; Capacitance: 10 µF; componentlink1description: Datasheet; componentlink1url: https://search.murata.co.jp/Ceramy/image/img/A01X/G101/ENG/ZRB18AC81A106KE01-01.pdf; componentlink2description: DigiKey Link; componentlink2url: https://www.digikey.com/en/products/detail/murata-electronics/ZRB18AC81A106KE01L/5321077; Device Package: 0603 (1608 Metric); Features: Interposer Termination; lastupdated: 2/9/2024 8:10:29 PM; Lifecycle Status: Active; Minimum Order: 1; Mounting Type: Surface Mount, MLCC; Operating Temperature: -55°C ~ 105°C; Package / Case: 0603 (1608 Metric); packaging: TapeAndReel; partid: 3376; Part Status: Active; price: 0.09; series: ZRB; Size / Dimension: 0.063" L x 0.031" W (1.60mm x 0.80mm); Supplier 1: DigiKey; Supplier Part Number 1: 490-10985-1-ND; Temperature Coefficient: X6S; Thickness (Max): 0.047" (1.20mm); Voltage - Rated: 10V
D13 = BAT60JFILM: DIODE SCHOTTKY 10V 3A SOD323; Manufacturer: STMicroelectronics; Current - Reverse Leakage @ Vr: 6 µA @ 10 V; Speed: Fast Recovery =< 500ns, > 200mA (Io); Voltage - Forward (Vf) (Max) @ If: 580 mV @ 1 A; Part Number: BAT60JFILM; ComponentLink1Description: Datasheet; ComponentLink1URL: http://www.st.com/content/ccc/resource/technical/document/datasheet/3d/d2/27/1d/20/e3/4d/48/CD00001944.pdf/files/CD00001944.pdf/jcr:content/translations/en.CD00001944.pdf; ComponentLink2Description: DigiKey Link; ComponentLink2URL: https://www.digikey.com/en/products/detail/stmicroelectronics/BAT60JFILM/686386; Current - Average Rectified (Io): 3A; Diode Type: Schottky; LastUpdated: 6/3/2024 8:20:13 PM; Lifecycle Status: Active; Minimum Order: 1; Mounting Type: Surface Mount; Operating Temperature - Junction: 150°C (Max); Package / Case: SC-76, SOD-323; Packaging: TapeAndReel; PartId: 3091; Part Status: Active; Price: 0.04; Series: -; Supplier 1: DigiKey; Supplier Part Number 1: 497-3707-1-ND; Supplier Device Package: SOD-323; Voltage - DC Reverse (Vr) (Max): 10 V
D14 D15 = LT Q39G-Q1OO-25-1: LED GREEN DIFFUSED 0603 SMD; Manufacturer: OSRAM Opto Semiconductors Inc.; Configuration: Standard; Current - Test: 5mA; Lens Color: White; Lens Size: 1.10mm x 0.80mm; Lens Style: Rectangle with Flat Top; Millicandela Rating: 175.5mcd; Viewing Angle: 170°, 130°; Voltage - Forward (Vf) (Typ): 2.85V; Wavelength - Dominant: 530nm; Wavelength - Peak: 525nm; Part Number: LT Q39G-Q1OO-25-1; Color: Green; ComponentLink1Description: Datasheet; ComponentLink1URL: https://dammedia.osram.info/media/resource/hires/osram-dam-2493418/LT%20Q39G.pdf; ComponentLink2Description: DigiKey Link; ComponentLink2URL: https://www.digikey.com/en/products/detail/osram-opto-semiconductors-inc/LT-Q39G-Q1OO-25-1/2793416; Device Package: 0603 (1608 Metric); Height (Max): 0.40mm; LastUpdated: 6/3/2024 7:58:51 PM; Lens Transparency: Diffused; Lifecycle Status: Active; Minimum Order: 1; Mounting Type: Surface Mount; Package / Case: 0603 (1608 Metric); Packaging: TapeAndReel; PartId: 689; Part Status: Active; Price: 0.07; Series: CHIPLED 0603; Size / Dimension: 1.60mm L x 0.80mm W; Supplier 1: DigiKey; Supplier Part Number 1: 475-3442-1-ND; Supplier Device Package: 0603; Value: Green
D16 D17 = SML-D13U8WT86: LED RED 0603 SMD; Manufacturer: Rohm Semiconductor; Current - Test: 20mA; Lens Size: 1.20mm x 0.80mm; Lens Style: Rectangle with Flat Top; Millicandela Rating: 70mcd; Voltage - Forward (Vf) (Typ): 2.2V; Wavelength - Dominant: 620nm; Part Number: SML-D13U8WT86; Color: Red; ComponentLink1Description: Datasheet; ComponentLink1URL: https://fscdn.rohm.com/en/products/databook/datasheet/opto/led/chip_mono/sml-d12x8_d13x8-e.pdf; ComponentLink2Description: DigiKey Link; ComponentLink2URL: https://www.digikey.com/en/products/detail/rohm-semiconductor/SML-D13U8WT86/16285870; Device Package: 0603 (1608 Metric); Height (Max): 0.65mm; LastUpdated: 6/3/2024 7:59:44 PM; Lifecycle Status: Active; Minimum Order: 1; Mounting Type: Surface Mount; Package / Case: 0603 (1608 Metric); Packaging: TapeAndReel; PartId: 1127; Part Status: Active; Price: 0.10; Series: SML-D12x8/D13x8; Size / Dimension: 1.60mm L x 0.80mm W; Supplier 1: DigiKey; Supplier Part Number 1: 846-SML-D13U8WT86CT-ND; Supplier Device Package: 0603; Value: Red
H1 = Header 3P 2.54 Duc Thang: Cắm; Ten_Linh_Kien: Header 3P XH2.54-3P Đực Thẳng; Don_Vi: Con; Ma_Hang: MH001292; Chung_Loai: Cắm
J3 = SS-52400-002: USB Type-C Connector | 1 Port | Right Angle Receptacle | Shielded | 0.039[1.00mm]; MF: Stewart Connector; Package: None; Mouser-Purchase-URL: https://snapeda.com/shop?store=Mouser&id=4629247; Value: *; Price: None; DigiKey-Purchase-URL: https://snapeda.com/shop?store=DigiKey&id=4629247; MP: SS-52400-002; Availability: Warning; SnapEDA_Link: https://www.snapeda.com/parts/SS-52400-002/Stewart%20Connector/view-part/4629247/?ref=snap
Q1 Q2 = FS8205A: N/A; MF: Fortune Semiconductor; MP: FS8205A; Value: *; Availability: Not in stock; Package: Package; Price: None; SnapEDA_Link: https://www.snapeda.com/parts/FS8205A/Fortune+Semiconductor/view-part/?ref=snap; Check_prices: https://www.snapeda.com/parts/FS8205A/Fortune+Semiconductor/view-part/?ref=eda
R23 = ERJ-2RKF1201X: RES SMD 1.2K OHM 1% 1/10W 0402; Manufacturer: Panasonic Electronic Components; Power (Watts): 0.1W, 1/10W; Temperature Coefficient: ±100ppm/°C; Part Number: ERJ-2RKF1201X; Value: 1.2 kOhms; ComponentLink1Description: Datasheet; ComponentLink1URL: https://industrial.panasonic.com/cdbs/www-data/pdf/RDA0000/AOA0000C304.pdf; ComponentLink2Description: DigiKey Link; ComponentLink2URL: https://www.digikey.com/en/products/detail/panasonic-electronic-components/ERJ-2RKF1201X/1746119; Composition: Thick Film; Device Package: 0402 (1005 Metric); Features: Automotive AEC-Q200; Height - Seated (Max): 0.016" (0.40mm); LastUpdated: 2/9/2024 8:30:04 PM; Lifecycle Status: Active; Minimum Order: 1; Number of Terminations: 2; Operating Temperature: -55°C ~ 155°C; Package / Case: 0402 (1005 Metric); Packaging: CutTape; PartId: 7242; Part Status: Active; Price: 0.01; Ratings: AEC-Q200; Resistance: 1.2 kOhms; Series: ERJ-2RK; Size / Dimension: 0.039" L x 0.020" W (1.00mm x 0.50mm); Supplier 1: DigiKey; Supplier Part Number 1: P1.20KLCT-ND; Supplier Device Package: 0402; Tolerance: ±1%
R24 = MCS04020C1201FE000: RES SMD 1.2K OHM 1% 1/10W 0402; Manufacturer: Vishay Beyschlag; Power (Watts): 0.1W, 1/10W; Temperature Coefficient: ±50ppm/°C; Part Number: MCS04020C1201FE000; Value: 1.2 kOhms; ComponentLink1Description: Datasheet; ComponentLink1URL: http://www.vishay.com/docs/28705/mcx0x0xpro.pdf; ComponentLink2Description: DigiKey Link; ComponentLink2URL: http://digikey.com/product-detail/en/vishay-beyschlag/MCS04020C1201FE000/749-MCS04020C1201FE000CT-ND/10453885; Composition: Thin Film; Device Package: 0402 (1005 Metric); Features: Anti-Sulfur; Height - Seated (Max): 0.015" (0.37mm); LastUpdated: 2/9/2024 8:30:06 PM; Lifecycle Status: Active; Minimum Order: 1; Number of Terminations: 2; Operating Temperature: -55°C ~ 155°C; Package / Case: 0402 (1005 Metric); Packaging: TapeAndReel; PartId: 6712; Part Status: Active; Price: 0.03; Resistance: 1.2 kOhms; Series: MCS - Professional; Size / Dimension: 0.039" L x 0.020" W (1.00mm x 0.50mm); Supplier 1: DigiKey; Supplier Part Number 1: 749-MCS04020C1201FE000CT-ND; Supplier Device Package: 0402; Tolerance: ±1%
R25 R26 R29-R32 = M55342E12B1B00RWS: RES SMD 1K OHM 0.1% 1/10W 0603; Manufacturer: Vishay Dale Thin Film; Power (Watts): 0.1W, 1/10W; Temperature Coefficient: ±25ppm/°C; Part Number: M55342E12B1B00RWS; Value: 1 kOhms; ComponentLink1Description: Datasheet; ComponentLink1URL: https://www.vishay.com/docs/60018/eh.pdf; ComponentLink2Description: DigiKey Link; ComponentLink2URL: https://www.digikey.com/en/products/detail/vishay-dale-thin-film/M55342E12B1B00RWS/3578912; Composition: Thin Film; Device Package: 0603 (1608 Metric); Failure Rate: R (0.01%); Features: Military, Non-Inductive; Height - Seated (Max): 0.033" (0.84mm); LastUpdated: 2/9/2024 8:40:47 PM; Lifecycle Status: Active; Minimum Order: 1; Number of Terminations: 2; Operating Temperature: -55°C ~ 150°C; Package / Case: 0603 (1608 Metric); Packaging: Tray; PartId: 75435; Part Status: Active; Price: 8.97; Resistance: 1 kOhms; Series: Military, MIL-PRF-55342, RM0603; Size / Dimension: 0.064" L x 0.032" W (1.63mm x 0.81mm); Supplier 1: DigiKey; Supplier Part Number 1: 764-M55342E12B1B00RWS-ND; Supplier Device Package: 0603; Tolerance: ±0.1%
R27 R28 = ERJ-PA3F1100V: RES SMD 110 OHM 1% 1/3W 0603; Manufacturer: Panasonic Electronic Components; Power (Watts): 0.333W, 1/3W; Temperature Coefficient: ±100ppm/°C; Part Number: ERJ-PA3F1100V; Value: 110 Ohms; ComponentLink1Description: Datasheet; ComponentLink1URL: https://industrial.panasonic.com/cdbs/www-data/pdf/RDO0000/AOA0000C331.pdf; ComponentLink2Description: DigiKey Link; ComponentLink2URL: https://www.digikey.com/en/products/detail/panasonic-electronic-components/ERJ-PA3F1100V/5035853; Composition: Thick Film; Device Package: 0603 (1608 Metric); Features: Automotive AEC-Q200, Pulse Withstanding; Height - Seated (Max): 0.022" (0.55mm); LastUpdated: 2/9/2024 8:43:28 PM; Lifecycle Status: Active; Minimum Order: 1; Number of Terminations: 2; Operating Temperature: -55°C ~ 155°C; Package / Case: 0603 (1608 Metric); Packaging: TapeAndReel; PartId: 7062; Part Status: Active; Price: 0.01; Ratings: AEC-Q200; Resistance: 110 Ohms; Series: ERJ-PA3; Size / Dimension: 0.063" L x 0.031" W (1.60mm x 0.80mm); Supplier 1: DigiKey; Supplier Part Number 1: P110BYCT-ND; Supplier Device Package: 0603; Tolerance: ±1%
U5 = USBLC6-2SC6: 17V Clamp 5A (8/20Âµs) Ipp Tvs Diode Surface Mount SOT-23-6; MF: STMicroelectronics; SnapEDA_Link: https://www.snapeda.com/parts/USBLC6-2SC6/STMicroelectronics/view-part/?ref=snap; Package: SOT-23-6 STMicroelectronics; Value: *; MP: USBLC6-2SC6; Check_prices: https://www.snapeda.com/parts/USBLC6-2SC6/STMicroelectronics/view-part/?ref=eda
U6 U7 = TP4056: Complete single cell Li-Ion battery with a constant current / constant voltage linear charger; MF: NanJing Top Power ASIC Corp.; Check_prices: https://www.snapeda.com/parts/TP4056/NanJing+Top+Power+ASIC+Corp./view-part/?ref=eda; SnapEDA_Link: https://www.snapeda.com/parts/TP4056/NanJing+Top+Power+ASIC+Corp./view-part/?ref=snap; Price: None; Availability: Not in stock; Package: Package; MP: TP4056; Value: *
U8 U9 = DW01A: One Cell Lithium-ion/Polymer Battery Protection IC; MF: Fortune Semiconductor; SnapEDA_Link: https://www.snapeda.com/parts/DW01A/Fortune+Semiconductor/view-part/?ref=snap; Package: SOT-23-6 Fortune Semiconductor; Value: *; MP: DW01A; Check_prices: https://www.snapeda.com/parts/DW01A/Fortune+Semiconductor/view-part/?ref=eda

## Nets that join several sheets
+5: MAIN_TX (H2.2 H3.2 P1.14), Audio (5 pins), Power_2 (11 pins), USB_C (9 pins)
+8.4: MAIN_TX (R8.2), Power_2 (5 pins)
GND: MAIN_TX (32 pins), Audio (11 pins), Power_2 (17 pins), USB_C (33 pins)
VCC: MAIN_TX (13 pins), Audio (6 pins), Power_2 (C22.2 R21.2 U3.2)
VCCNRF: MAIN_TX (C12.1 JP1.4), Power_2 (C25.2 R22.2 U4.2)
Audio_PWM: MAIN_TX (IC1.39), Audio (R10.1)
CLK_SD: MAIN_TX (IC1.51), Audio (P2.5)
CS_SD: MAIN_TX (IC1.50), Audio (P2.2 R16.1)
MISO_SD: MAIN_TX (IC1.52), Audio (P2.7 R13.1)
MOSI_SD: MAIN_TX (IC1.53), Audio (P2.3 R12.1)
USB_DM: MAIN_TX (IC1.44), USB_C (U5.6)
USB_DP: MAIN_TX (IC1.45), USB_C (U5.4)